# EAGLE schematic TestBoard1 (EAGLE 6.4)
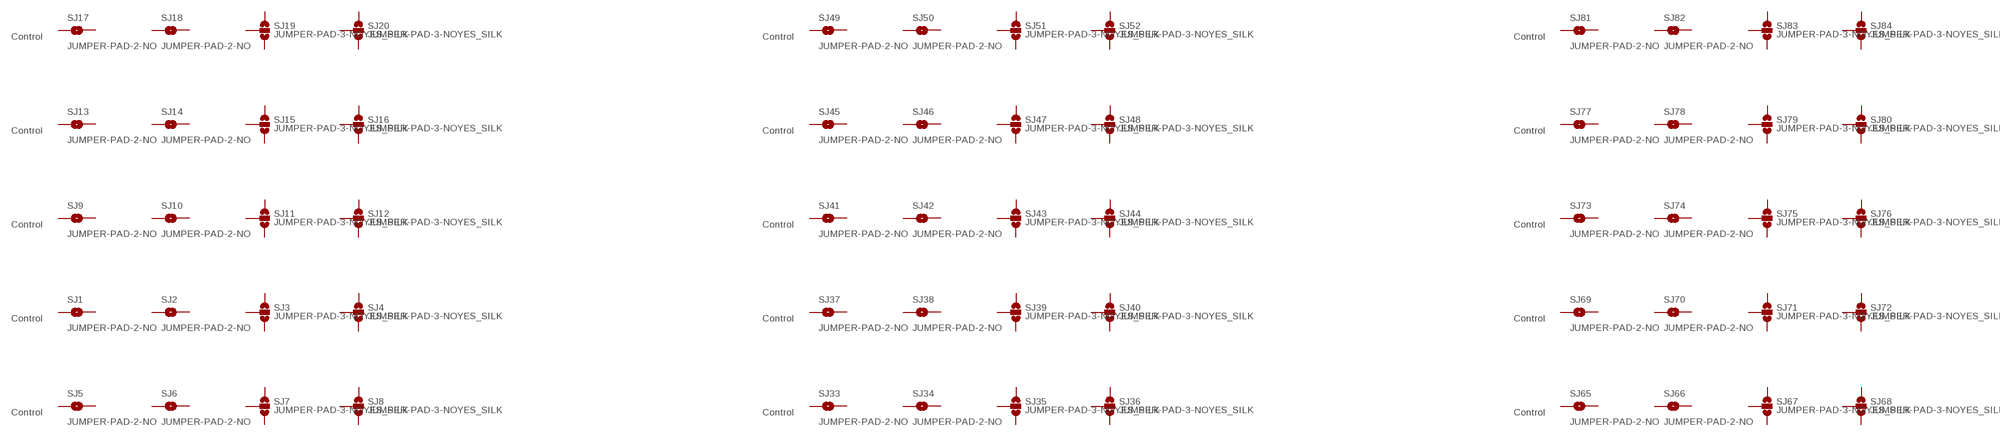
[diagram p0: schematic, sheet 1, part 1 of 3]
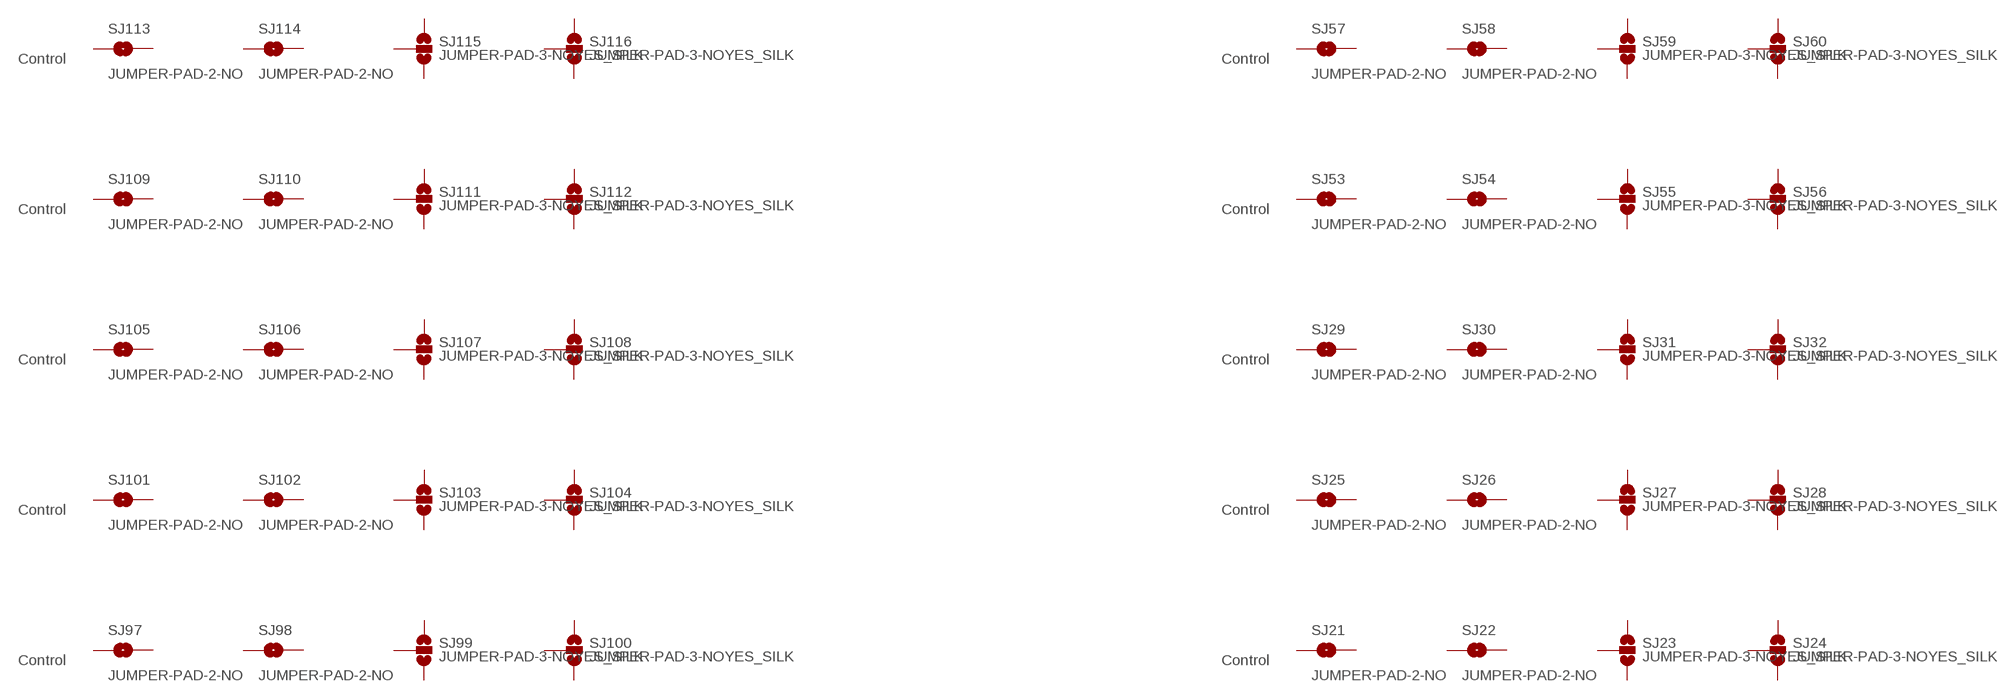
[diagram p1: schematic, sheet 1, part 2 of 3]
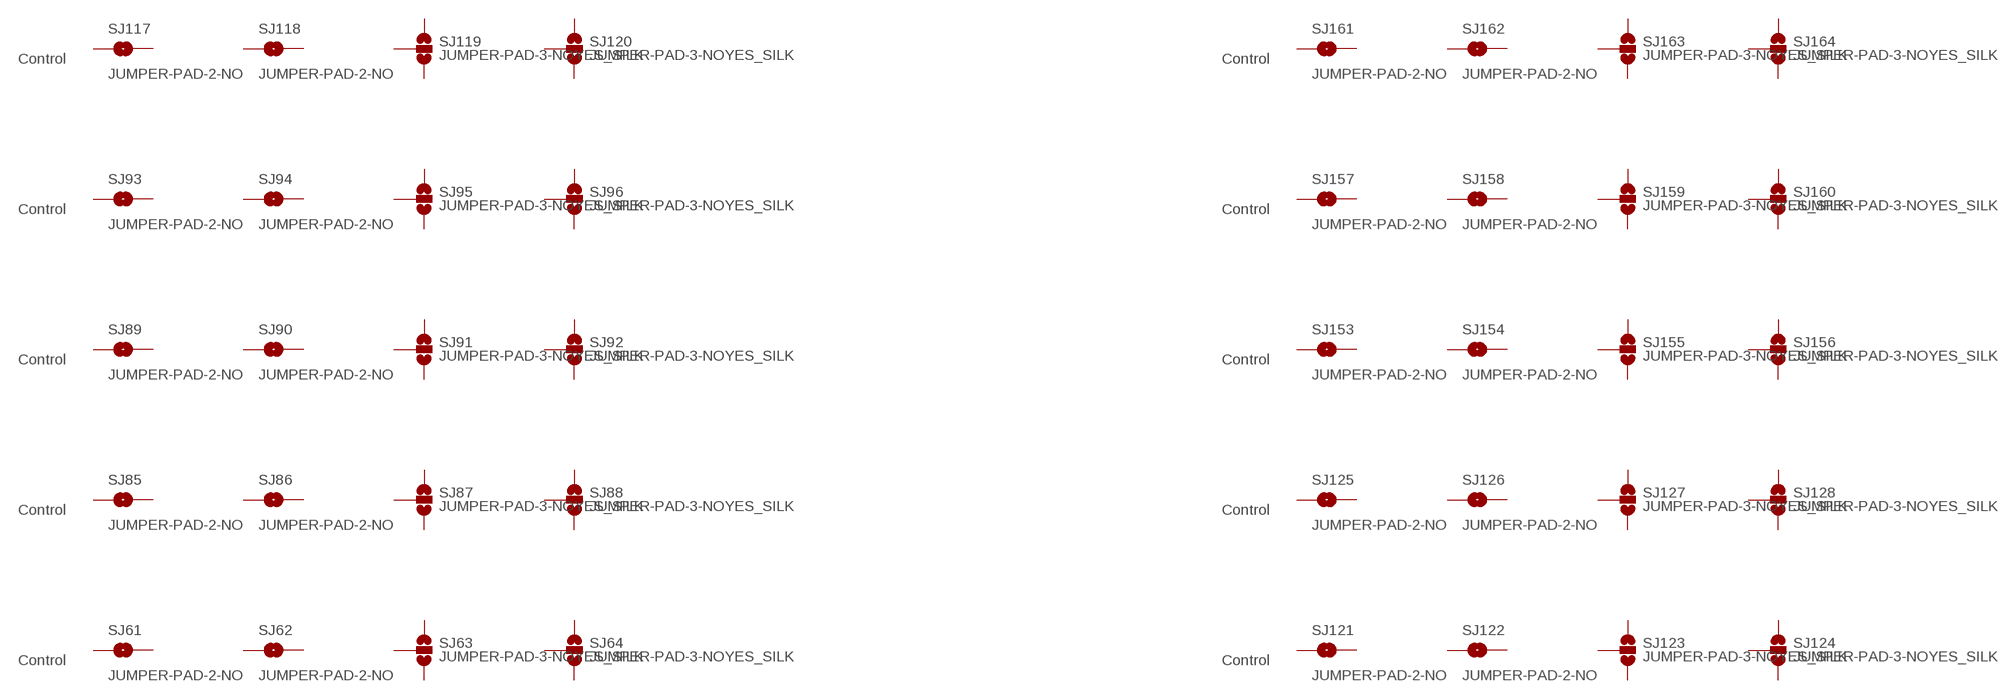
[diagram p2: schematic, sheet 1, part 3 of 3]

## Parts
SJ1  JUMPER-PAD-2-NO  [PAD-JUMPER-2-NO_NO_SILK]
SJ2  JUMPER-PAD-2-NO  [PAD-JUMPER-2-NO_NO_SILK]
SJ3  JUMPER-PAD-3-NOYES_SILK  [PAD-JUMPER-3-NO_YES_SILK]
SJ4  JUMPER-PAD-3-NOYES_SILK  [PAD-JUMPER-3-NO_YES_SILK]
SJ5  JUMPER-PAD-2-NO  [PAD-JUMPER-2-NO_NO_SILK]
SJ6  JUMPER-PAD-2-NO  [PAD-JUMPER-2-NO_NO_SILK]
SJ7  JUMPER-PAD-3-NOYES_SILK  [PAD-JUMPER-3-NO_YES_SILK]
SJ8  JUMPER-PAD-3-NOYES_SILK  [PAD-JUMPER-3-NO_YES_SILK]
SJ9  JUMPER-PAD-2-NO  [PAD-JUMPER-2-NO_NO_SILK]
SJ10  JUMPER-PAD-2-NO  [PAD-JUMPER-2-NO_NO_SILK]
SJ11  JUMPER-PAD-3-NOYES_SILK  [PAD-JUMPER-3-NO_YES_SILK]
SJ12  JUMPER-PAD-3-NOYES_SILK  [PAD-JUMPER-3-NO_YES_SILK]
SJ13  JUMPER-PAD-2-NO  [PAD-JUMPER-2-NO_NO_SILK]
SJ14  JUMPER-PAD-2-NO  [PAD-JUMPER-2-NO_NO_SILK]
SJ15  JUMPER-PAD-3-NOYES_SILK  [PAD-JUMPER-3-NO_YES_SILK]
SJ16  JUMPER-PAD-3-NOYES_SILK  [PAD-JUMPER-3-NO_YES_SILK]
SJ17  JUMPER-PAD-2-NO  [PAD-JUMPER-2-NO_NO_SILK]
SJ18  JUMPER-PAD-2-NO  [PAD-JUMPER-2-NO_NO_SILK]
SJ19  JUMPER-PAD-3-NOYES_SILK  [PAD-JUMPER-3-NO_YES_SILK]
SJ20  JUMPER-PAD-3-NOYES_SILK  [PAD-JUMPER-3-NO_YES_SILK]
SJ21  JUMPER-PAD-2-NO  [PAD-JUMPER-2-NO_NO_SILK]
SJ22  JUMPER-PAD-2-NO  [PAD-JUMPER-2-NO_NO_SILK]
SJ23  JUMPER-PAD-3-NOYES_SILK  [PAD-JUMPER-3-NO_YES_SILK]
SJ24  JUMPER-PAD-3-NOYES_SILK  [PAD-JUMPER-3-NO_YES_SILK]
SJ25  JUMPER-PAD-2-NO  [PAD-JUMPER-2-NO_NO_SILK]
SJ26  JUMPER-PAD-2-NO  [PAD-JUMPER-2-NO_NO_SILK]
SJ27  JUMPER-PAD-3-NOYES_SILK  [PAD-JUMPER-3-NO_YES_SILK]
SJ28  JUMPER-PAD-3-NOYES_SILK  [PAD-JUMPER-3-NO_YES_SILK]
SJ29  JUMPER-PAD-2-NO  [PAD-JUMPER-2-NO_NO_SILK]
SJ30  JUMPER-PAD-2-NO  [PAD-JUMPER-2-NO_NO_SILK]
SJ31  JUMPER-PAD-3-NOYES_SILK  [PAD-JUMPER-3-NO_YES_SILK]
SJ32  JUMPER-PAD-3-NOYES_SILK  [PAD-JUMPER-3-NO_YES_SILK]
SJ33  JUMPER-PAD-2-NO  [PAD-JUMPER-2-NO_NO_SILK]
SJ34  JUMPER-PAD-2-NO  [PAD-JUMPER-2-NO_NO_SILK]
SJ35  JUMPER-PAD-3-NOYES_SILK  [PAD-JUMPER-3-NO_YES_SILK]
SJ36  JUMPER-PAD-3-NOYES_SILK  [PAD-JUMPER-3-NO_YES_SILK]
SJ37  JUMPER-PAD-2-NO  [PAD-JUMPER-2-NO_NO_SILK]
SJ38  JUMPER-PAD-2-NO  [PAD-JUMPER-2-NO_NO_SILK]
SJ39  JUMPER-PAD-3-NOYES_SILK  [PAD-JUMPER-3-NO_YES_SILK]
SJ40  JUMPER-PAD-3-NOYES_SILK  [PAD-JUMPER-3-NO_YES_SILK]
SJ41  JUMPER-PAD-2-NO  [PAD-JUMPER-2-NO_NO_SILK]
SJ42  JUMPER-PAD-2-NO  [PAD-JUMPER-2-NO_NO_SILK]
SJ43  JUMPER-PAD-3-NOYES_SILK  [PAD-JUMPER-3-NO_YES_SILK]
SJ44  JUMPER-PAD-3-NOYES_SILK  [PAD-JUMPER-3-NO_YES_SILK]
SJ45  JUMPER-PAD-2-NO  [PAD-JUMPER-2-NO_NO_SILK]
SJ46  JUMPER-PAD-2-NO  [PAD-JUMPER-2-NO_NO_SILK]
SJ47  JUMPER-PAD-3-NOYES_SILK  [PAD-JUMPER-3-NO_YES_SILK]
SJ48  JUMPER-PAD-3-NOYES_SILK  [PAD-JUMPER-3-NO_YES_SILK]
SJ49  JUMPER-PAD-2-NO  [PAD-JUMPER-2-NO_NO_SILK]
SJ50  JUMPER-PAD-2-NO  [PAD-JUMPER-2-NO_NO_SILK]
SJ51  JUMPER-PAD-3-NOYES_SILK  [PAD-JUMPER-3-NO_YES_SILK]
SJ52  JUMPER-PAD-3-NOYES_SILK  [PAD-JUMPER-3-NO_YES_SILK]
SJ53  JUMPER-PAD-2-NO  [PAD-JUMPER-2-NO_NO_SILK]
SJ54  JUMPER-PAD-2-NO  [PAD-JUMPER-2-NO_NO_SILK]
SJ55  JUMPER-PAD-3-NOYES_SILK  [PAD-JUMPER-3-NO_YES_SILK]
SJ56  JUMPER-PAD-3-NOYES_SILK  [PAD-JUMPER-3-NO_YES_SILK]
SJ57  JUMPER-PAD-2-NO  [PAD-JUMPER-2-NO_NO_SILK]
SJ58  JUMPER-PAD-2-NO  [PAD-JUMPER-2-NO_NO_SILK]
SJ59  JUMPER-PAD-3-NOYES_SILK  [PAD-JUMPER-3-NO_YES_SILK]
SJ60  JUMPER-PAD-3-NOYES_SILK  [PAD-JUMPER-3-NO_YES_SILK]
SJ61  JUMPER-PAD-2-NO  [PAD-JUMPER-2-NO_NO_SILK]
SJ62  JUMPER-PAD-2-NO  [PAD-JUMPER-2-NO_NO_SILK]
SJ63  JUMPER-PAD-3-NOYES_SILK  [PAD-JUMPER-3-NO_YES_SILK]
SJ64  JUMPER-PAD-3-NOYES_SILK  [PAD-JUMPER-3-NO_YES_SILK]
SJ65  JUMPER-PAD-2-NO  [PAD-JUMPER-2-NO_NO_SILK]
SJ66  JUMPER-PAD-2-NO  [PAD-JUMPER-2-NO_NO_SILK]
SJ67  JUMPER-PAD-3-NOYES_SILK  [PAD-JUMPER-3-NO_YES_SILK]
SJ68  JUMPER-PAD-3-NOYES_SILK  [PAD-JUMPER-3-NO_YES_SILK]
SJ69  JUMPER-PAD-2-NO  [PAD-JUMPER-2-NO_NO_SILK]
SJ70  JUMPER-PAD-2-NO  [PAD-JUMPER-2-NO_NO_SILK]
SJ71  JUMPER-PAD-3-NOYES_SILK  [PAD-JUMPER-3-NO_YES_SILK]
SJ72  JUMPER-PAD-3-NOYES_SILK  [PAD-JUMPER-3-NO_YES_SILK]
SJ73  JUMPER-PAD-2-NO  [PAD-JUMPER-2-NO_NO_SILK]
SJ74  JUMPER-PAD-2-NO  [PAD-JUMPER-2-NO_NO_SILK]
SJ75  JUMPER-PAD-3-NOYES_SILK  [PAD-JUMPER-3-NO_YES_SILK]
SJ76  JUMPER-PAD-3-NOYES_SILK  [PAD-JUMPER-3-NO_YES_SILK]
SJ77  JUMPER-PAD-2-NO  [PAD-JUMPER-2-NO_NO_SILK]
SJ78  JUMPER-PAD-2-NO  [PAD-JUMPER-2-NO_NO_SILK]
SJ79  JUMPER-PAD-3-NOYES_SILK  [PAD-JUMPER-3-NO_YES_SILK]
SJ80  JUMPER-PAD-3-NOYES_SILK  [PAD-JUMPER-3-NO_YES_SILK]
SJ81  JUMPER-PAD-2-NO  [PAD-JUMPER-2-NO_NO_SILK]
SJ82  JUMPER-PAD-2-NO  [PAD-JUMPER-2-NO_NO_SILK]
SJ83  JUMPER-PAD-3-NOYES_SILK  [PAD-JUMPER-3-NO_YES_SILK]
SJ84  JUMPER-PAD-3-NOYES_SILK  [PAD-JUMPER-3-NO_YES_SILK]
SJ85  JUMPER-PAD-2-NO  [PAD-JUMPER-2-NO_NO_SILK]
SJ86  JUMPER-PAD-2-NO  [PAD-JUMPER-2-NO_NO_SILK]
SJ87  JUMPER-PAD-3-NOYES_SILK  [PAD-JUMPER-3-NO_YES_SILK]
SJ88  JUMPER-PAD-3-NOYES_SILK  [PAD-JUMPER-3-NO_YES_SILK]
SJ89  JUMPER-PAD-2-NO  [PAD-JUMPER-2-NO_NO_SILK]
SJ90  JUMPER-PAD-2-NO  [PAD-JUMPER-2-NO_NO_SILK]
SJ91  JUMPER-PAD-3-NOYES_SILK  [PAD-JUMPER-3-NO_YES_SILK]
SJ92  JUMPER-PAD-3-NOYES_SILK  [PAD-JUMPER-3-NO_YES_SILK]
SJ93  JUMPER-PAD-2-NO  [PAD-JUMPER-2-NO_NO_SILK]
SJ94  JUMPER-PAD-2-NO  [PAD-JUMPER-2-NO_NO_SILK]
SJ95  JUMPER-PAD-3-NOYES_SILK  [PAD-JUMPER-3-NO_YES_SILK]
SJ96  JUMPER-PAD-3-NOYES_SILK  [PAD-JUMPER-3-NO_YES_SILK]
SJ97  JUMPER-PAD-2-NO  [PAD-JUMPER-2-NO_NO_SILK]
SJ98  JUMPER-PAD-2-NO  [PAD-JUMPER-2-NO_NO_SILK]
SJ99  JUMPER-PAD-3-NOYES_SILK  [PAD-JUMPER-3-NO_YES_SILK]
SJ100  JUMPER-PAD-3-NOYES_SILK  [PAD-JUMPER-3-NO_YES_SILK]
SJ101  JUMPER-PAD-2-NO  [PAD-JUMPER-2-NO_NO_SILK]
SJ102  JUMPER-PAD-2-NO  [PAD-JUMPER-2-NO_NO_SILK]
SJ103  JUMPER-PAD-3-NOYES_SILK  [PAD-JUMPER-3-NO_YES_SILK]
SJ104  JUMPER-PAD-3-NOYES_SILK  [PAD-JUMPER-3-NO_YES_SILK]
SJ105  JUMPER-PAD-2-NO  [PAD-JUMPER-2-NO_NO_SILK]
SJ106  JUMPER-PAD-2-NO  [PAD-JUMPER-2-NO_NO_SILK]
SJ107  JUMPER-PAD-3-NOYES_SILK  [PAD-JUMPER-3-NO_YES_SILK]
SJ108  JUMPER-PAD-3-NOYES_SILK  [PAD-JUMPER-3-NO_YES_SILK]
SJ109  JUMPER-PAD-2-NO  [PAD-JUMPER-2-NO_NO_SILK]
SJ110  JUMPER-PAD-2-NO  [PAD-JUMPER-2-NO_NO_SILK]
SJ111  JUMPER-PAD-3-NOYES_SILK  [PAD-JUMPER-3-NO_YES_SILK]
SJ112  JUMPER-PAD-3-NOYES_SILK  [PAD-JUMPER-3-NO_YES_SILK]
SJ113  JUMPER-PAD-2-NO  [PAD-JUMPER-2-NO_NO_SILK]
SJ114  JUMPER-PAD-2-NO  [PAD-JUMPER-2-NO_NO_SILK]
SJ115  JUMPER-PAD-3-NOYES_SILK  [PAD-JUMPER-3-NO_YES_SILK]
SJ116  JUMPER-PAD-3-NOYES_SILK  [PAD-JUMPER-3-NO_YES_SILK]
SJ117  JUMPER-PAD-2-NO  [PAD-JUMPER-2-NO_NO_SILK]
SJ118  JUMPER-PAD-2-NO  [PAD-JUMPER-2-NO_NO_SILK]
SJ119  JUMPER-PAD-3-NOYES_SILK  [PAD-JUMPER-3-NO_YES_SILK]
SJ120  JUMPER-PAD-3-NOYES_SILK  [PAD-JUMPER-3-NO_YES_SILK]
SJ121  JUMPER-PAD-2-NO  [PAD-JUMPER-2-NO_NO_SILK]
SJ122  JUMPER-PAD-2-NO  [PAD-JUMPER-2-NO_NO_SILK]
SJ123  JUMPER-PAD-3-NOYES_SILK  [PAD-JUMPER-3-NO_YES_SILK]
SJ124  JUMPER-PAD-3-NOYES_SILK  [PAD-JUMPER-3-NO_YES_SILK]
SJ125  JUMPER-PAD-2-NO  [PAD-JUMPER-2-NO_NO_SILK]
SJ126  JUMPER-PAD-2-NO  [PAD-JUMPER-2-NO_NO_SILK]
SJ127  JUMPER-PAD-3-NOYES_SILK  [PAD-JUMPER-3-NO_YES_SILK]
SJ128  JUMPER-PAD-3-NOYES_SILK  [PAD-JUMPER-3-NO_YES_SILK]
SJ153  JUMPER-PAD-2-NO  [PAD-JUMPER-2-NO_NO_SILK]
SJ154  JUMPER-PAD-2-NO  [PAD-JUMPER-2-NO_NO_SILK]
SJ155  JUMPER-PAD-3-NOYES_SILK  [PAD-JUMPER-3-NO_YES_SILK]
SJ156  JUMPER-PAD-3-NOYES_SILK  [PAD-JUMPER-3-NO_YES_SILK]
SJ157  JUMPER-PAD-2-NO  [PAD-JUMPER-2-NO_NO_SILK]
SJ158  JUMPER-PAD-2-NO  [PAD-JUMPER-2-NO_NO_SILK]
SJ159  JUMPER-PAD-3-NOYES_SILK  [PAD-JUMPER-3-NO_YES_SILK]
SJ160  JUMPER-PAD-3-NOYES_SILK  [PAD-JUMPER-3-NO_YES_SILK]
SJ161  JUMPER-PAD-2-NO  [PAD-JUMPER-2-NO_NO_SILK]
SJ162  JUMPER-PAD-2-NO  [PAD-JUMPER-2-NO_NO_SILK]
SJ163  JUMPER-PAD-3-NOYES_SILK  [PAD-JUMPER-3-NO_YES_SILK]
SJ164  JUMPER-PAD-3-NOYES_SILK  [PAD-JUMPER-3-NO_YES_SILK]
Unconnected: SJ1.1 SJ1.2 SJ2.1 SJ2.2 SJ3.1 SJ3.2 SJ3.3 SJ4.1 SJ4.2 SJ4.3 SJ5.1 SJ5.2 SJ6.1 SJ6.2 SJ7.1 SJ7.2 SJ7.3 SJ8.1 SJ8.2 SJ8.3 SJ9.1 SJ9.2 SJ10.1 SJ10.2 SJ11.1 SJ11.2 SJ11.3 SJ12.1 SJ12.2 SJ12.3 SJ13.1 SJ13.2 SJ14.1 SJ14.2 SJ15.1 SJ15.2 SJ15.3 SJ16.1 SJ16.2 SJ16.3 SJ17.1 SJ17.2 SJ18.1 SJ18.2 SJ19.1 SJ19.2 SJ19.3 SJ20.1 SJ20.2 SJ20.3 SJ21.1 SJ21.2 SJ22.1 SJ22.2 SJ23.1 SJ23.2 SJ23.3 SJ24.1 SJ24.2 SJ24.3 SJ25.1 SJ25.2 SJ26.1 SJ26.2 SJ27.1 SJ27.2 SJ27.3 SJ28.1 SJ28.2 SJ28.3 SJ29.1 SJ29.2 SJ30.1 SJ30.2 SJ31.1 SJ31.2 SJ31.3 SJ32.1 SJ32.2 SJ32.3 SJ33.1 SJ33.2 SJ34.1 SJ34.2 SJ35.1 SJ35.2 SJ35.3 SJ36.1 SJ36.2 SJ36.3 SJ37.1 SJ37.2 SJ38.1 SJ38.2 SJ39.1 SJ39.2 SJ39.3 SJ40.1 SJ40.2 SJ40.3 SJ41.1 SJ41.2 SJ42.1 SJ42.2 SJ43.1 SJ43.2 SJ43.3 SJ44.1 SJ44.2 SJ44.3 SJ45.1 SJ45.2 SJ46.1 SJ46.2 SJ47.1 SJ47.2 SJ47.3 SJ48.1 SJ48.2 SJ48.3 SJ49.1 SJ49.2 SJ50.1 SJ50.2 SJ51.1 SJ51.2 SJ51.3 SJ52.1 SJ52.2 SJ52.3 SJ53.1 SJ53.2 SJ54.1 SJ54.2 SJ55.1 SJ55.2 SJ55.3 SJ56.1 SJ56.2 SJ56.3 SJ57.1 SJ57.2 SJ58.1 SJ58.2 SJ59.1 SJ59.2 SJ59.3 SJ60.1 SJ60.2 SJ60.3 SJ61.1 SJ61.2 SJ62.1 SJ62.2 SJ63.1 SJ63.2 SJ63.3 SJ64.1 SJ64.2 SJ64.3 SJ65.1 SJ65.2 SJ66.1 SJ66.2 SJ67.1 SJ67.2 SJ67.3 SJ68.1 SJ68.2 SJ68.3 SJ69.1 SJ69.2 SJ70.1 SJ70.2 SJ71.1 SJ71.2 SJ71.3 SJ72.1 SJ72.2 SJ72.3 SJ73.1 SJ73.2 SJ74.1 SJ74.2 SJ75.1 SJ75.2 SJ75.3 SJ76.1 SJ76.2 SJ76.3 SJ77.1 SJ77.2 SJ78.1 SJ78.2 SJ79.1 SJ79.2 SJ79.3 SJ80.1 SJ80.2 SJ80.3 SJ81.1 SJ81.2 SJ82.1 SJ82.2 SJ83.1 SJ83.2 SJ83.3 SJ84.1 SJ84.2 SJ84.3 SJ85.1 SJ85.2 SJ86.1 SJ86.2 SJ87.1 SJ87.2 SJ87.3 SJ88.1 SJ88.2 SJ88.3 SJ89.1 SJ89.2 SJ90.1 SJ90.2 SJ91.1 SJ91.2 SJ91.3 SJ92.1 SJ92.2 SJ92.3 SJ93.1 SJ93.2 SJ94.1 SJ94.2 SJ95.1 SJ95.2 SJ95.3 SJ96.1 SJ96.2 SJ96.3 SJ97.1 SJ97.2 SJ98.1 SJ98.2 SJ99.1 SJ99.2 SJ99.3 SJ100.1 SJ100.2 SJ100.3 SJ101.1 SJ101.2 SJ102.1 SJ102.2 SJ103.1 SJ103.2 SJ103.3 SJ104.1 SJ104.2 SJ104.3 SJ105.1 SJ105.2 SJ106.1 SJ106.2 SJ107.1 SJ107.2 SJ107.3 SJ108.1 SJ108.2 SJ108.3 SJ109.1 SJ109.2 SJ110.1 SJ110.2 SJ111.1 SJ111.2 SJ111.3 SJ112.1 SJ112.2 SJ112.3 SJ113.1 SJ113.2 SJ114.1 SJ114.2 SJ115.1 SJ115.2 SJ115.3 SJ116.1 SJ116.2 SJ116.3 SJ117.1 SJ117.2 SJ118.1 SJ118.2 SJ119.1 SJ119.2 SJ119.3 SJ120.1 SJ120.2 SJ120.3 SJ121.1 SJ121.2 SJ122.1 SJ122.2 SJ123.1 SJ123.2 SJ123.3 SJ124.1 SJ124.2 SJ124.3 SJ125.1 SJ125.2 SJ126.1 SJ126.2 SJ127.1 SJ127.2 SJ127.3 SJ128.1 SJ128.2 SJ128.3 SJ153.1 SJ153.2 SJ154.1 SJ154.2 SJ155.1 SJ155.2 SJ155.3 SJ156.1 SJ156.2 SJ156.3 SJ157.1 SJ157.2 SJ158.1 SJ158.2 SJ159.1 SJ159.2 SJ159.3 SJ160.1 SJ160.2 SJ160.3 SJ161.1 SJ161.2 SJ162.1 SJ162.2 SJ163.1 SJ163.2 SJ163.3 SJ164.1 SJ164.2 SJ164.3

## Notes on the sheet
- Control | Control | Control | Control | Control | Control | Control
- Control | Control | Control | Control | Control | Control | Control
- Control | Control | Control | Control | Control | Control | Control
- Control | Control | Control | Control | Control | Control | Control
- Control | Control | Control | Control | Control | Control | Control

## Library data of the parts
SJ1 SJ2 SJ5 SJ6 SJ9 SJ10 SJ13 SJ14 SJ17 SJ18 SJ21 SJ22 SJ25 SJ26 SJ29 SJ30 SJ33 SJ34 SJ37 SJ38 SJ41 SJ42 SJ45 SJ46 SJ49 SJ50 SJ53 SJ54 SJ57 SJ58 SJ61 SJ62 SJ65 SJ66 SJ69 SJ70 SJ73 SJ74 SJ77 SJ78 SJ81 SJ82 SJ85 SJ86 SJ89 SJ90 SJ93 SJ94 SJ97 SJ98 SJ101 SJ102 SJ105 SJ106 SJ109 SJ110 SJ113 SJ114 SJ117 SJ118 SJ121 SJ122 SJ125 SJ126 SJ153 SJ154 SJ157 SJ158 SJ161 SJ162 = TestAperatures:JUMPER-PAD-2-NO
SJ3 SJ4 SJ7 SJ8 SJ11 SJ12 SJ15 SJ16 SJ19 SJ20 SJ23 SJ24 SJ27 SJ28 SJ31 SJ32 SJ35 SJ36 SJ39 SJ40 SJ43 SJ44 SJ47 SJ48 SJ51 SJ52 SJ55 SJ56 SJ59 SJ60 SJ63 SJ64 SJ67 SJ68 SJ71 SJ72 SJ75 SJ76 SJ79 SJ80 SJ83 SJ84 SJ87 SJ88 SJ91 SJ92 SJ95 SJ96 SJ99 SJ100 SJ103 SJ104 SJ107 SJ108 SJ111 SJ112 SJ115 SJ116 SJ119 SJ120 SJ123 SJ124 SJ127 SJ128 SJ155 SJ156 SJ159 SJ160 SJ163 SJ164 = TestAperatures:JUMPER-PAD-3-NO